# EAGLE design bicyclelab-manager-v3.1 (EAGLE 6.2)
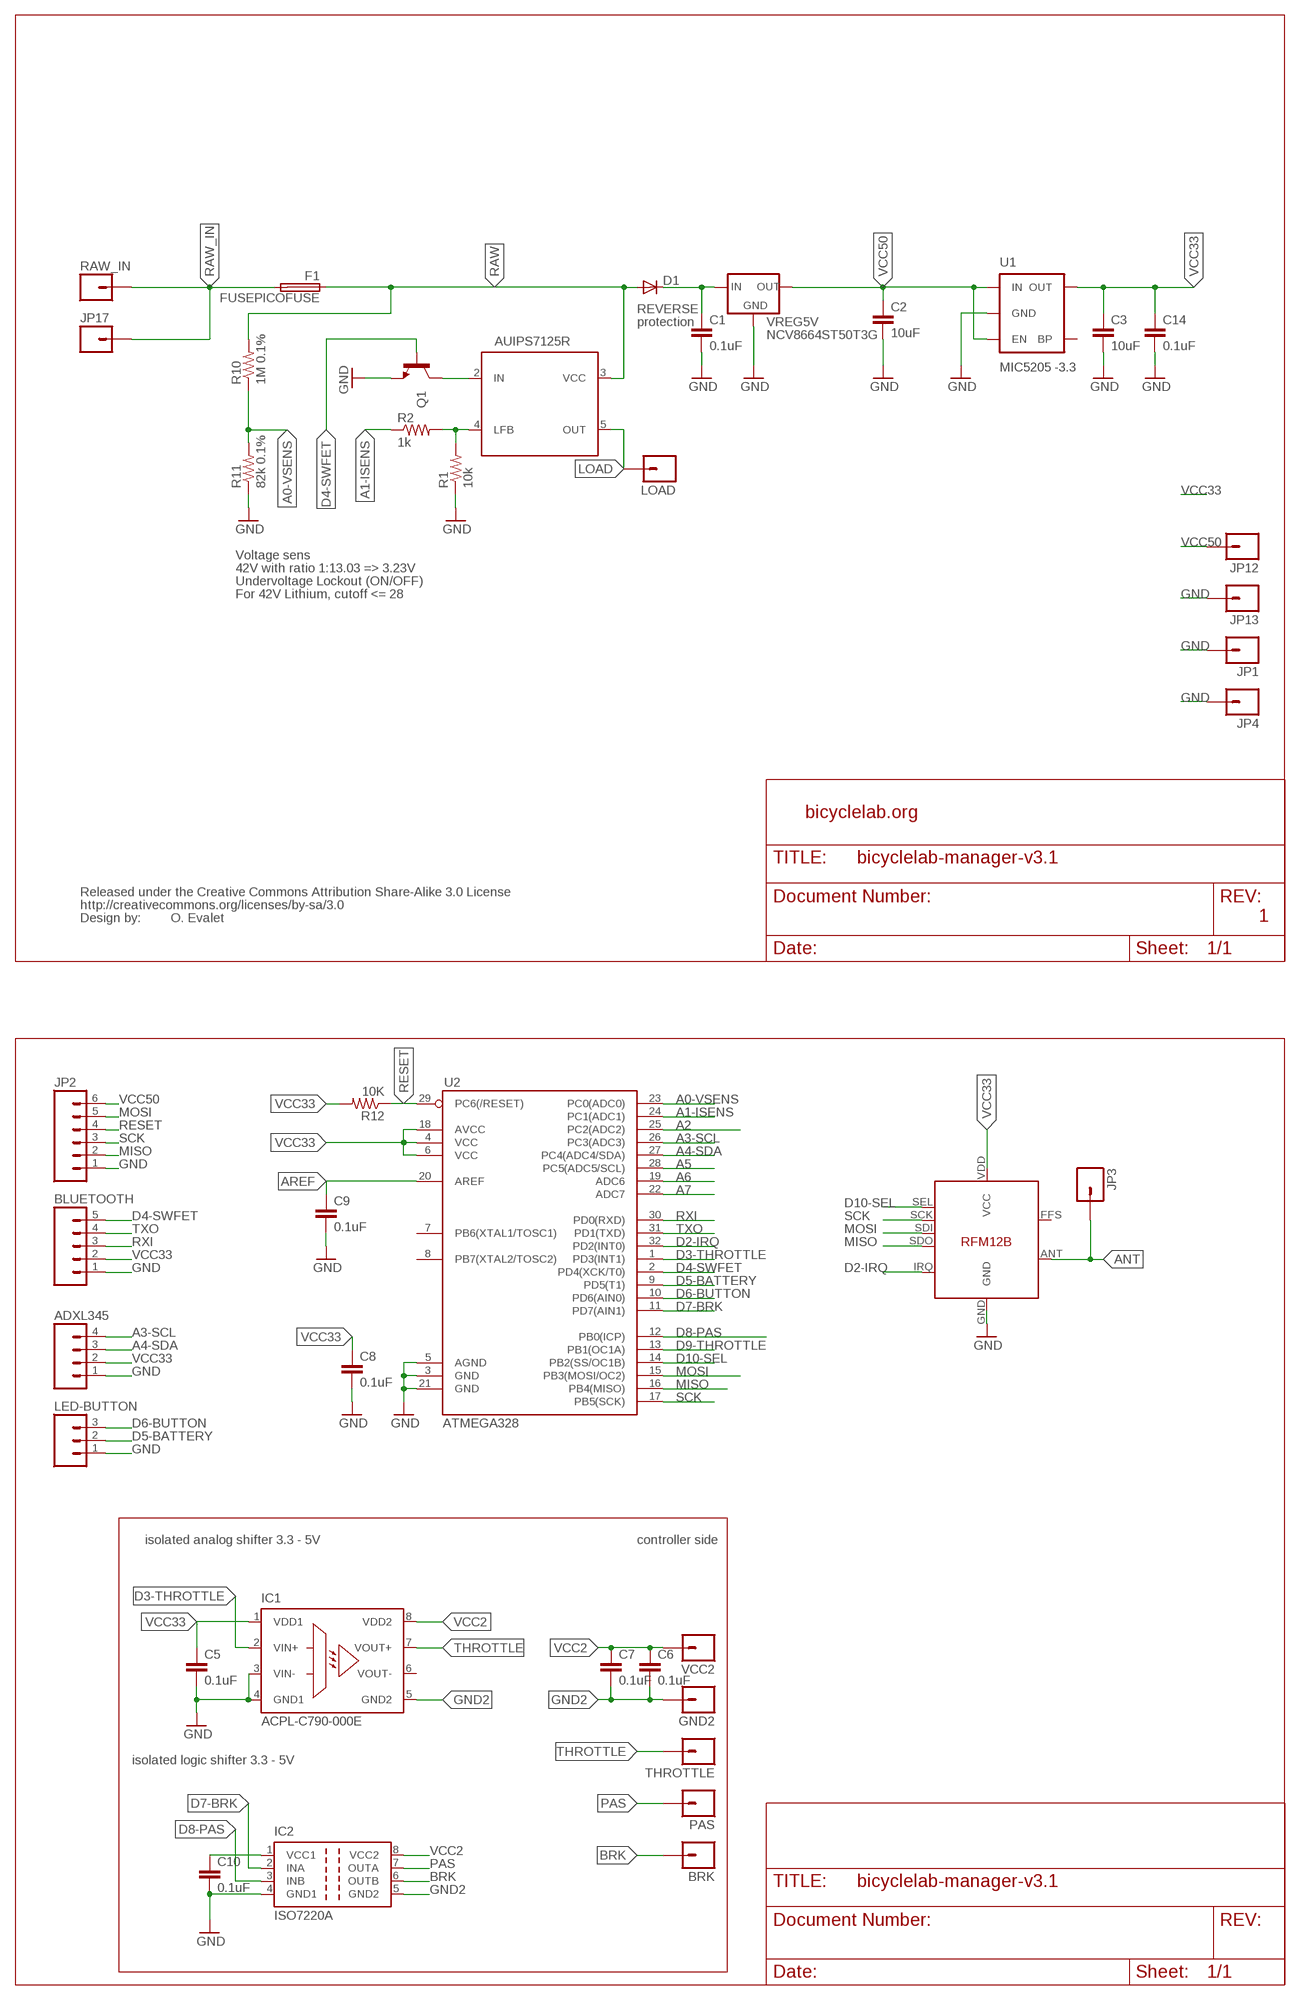
[diagram p0: schematic, sheet 1]

## Parts
ADXL345  M04PTH  [1X04]
BLUETOOTH  M05PTH  [1X05]
BRK  M01PTH  [1X01]
C1  0.1uF  CAP0805  [0805]
C2  10uF  CAP0805  [0805]
C3  10uF  CAP0805  [0805]
C5  0.1uF  CAP0805  [0805]
C6  0.1uF  CAP0805  [0805]
C7  0.1uF  CAP0805  [0805]
C8  0.1uF  CAP0603-CAP  [0603-CAP]
C9  0.1uF  CAP0603-CAP  [0603-CAP]
C10  0.1uF  CAP0805  [0805]
C14  0.1uF  CAP0603-CAP  [0603-CAP]
D1  DIODESOD  [SOD-323]
F1  FUSEPICOFUSE  [PICOFUSE]
GND2  M01PTH  [1X01]
IC1  ACPL-C790-000E  ACPL-790SSO8  [SSO8]
IC2  ISO7220A  [SO-08]
JP1  M01PTH_2MM  [1X01_2MM]
JP2  M06EM406  [EM406]
JP3  M01SMD-4.5X1.5  [PAD-1.5X4.5]
JP4  M01PTH_2MM  [1X01_2MM]
JP12  M01PTH  [1X01]
JP13  M01PTH  [1X01]
JP17  M01PTH_2MM  [1X01_2MM]
LED-BUTTON  M03PTH  [1X03]
LOAD  M01PTH_2MM  [1X01_2MM]
PAS  M01PTH  [1X01]
Q1  TRANSISTOR_NPNSOT23-3  [SOT23-3]
R1  10k  RESISTOR  [0805]
R2  1k  RESISTOR  [0805]
R10  1M 0.1%  RESISTOR  [0805]
R11  82k 0.1%  RESISTOR  [0805]
R12  10K  RESISTOR0603-RES  [0603-RES]
RAW_IN  M01PTH_2MM  [1X01_2MM]
THROTTLE  M01PTH  [1X01]
U1  MIC5205 -3.3  V_REG_LDOSMD  [SOT23-5]
U2  ATMEGA328  ATMEGA168  [TQFP32-08]
U$1  RFM12B  [RFM12B]
U$5  CREATIVE_COMMONS  [CREATIVE_COMMONS]
U$8  AUIPS7125R  [DPAK-5]
VCC2  M01PTH  [1X01]
VREG5V  NCV8664ST50T3G  V_REG_MIC2920  [SOT223]

## Nets
A0-VSENS: R10.1 R11.2 U2.23(PC0(ADC0))
A1-ISENS: R1.2 R2.1 R2.2 U2.24(PC1(ADC1)) U$8.4(LFB)
A2: U2.25(PC2(ADC2))
A3-SCL: ADXL345.4 U2.26(PC3(ADC3))
A4-SDA: ADXL345.3 U2.27(PC4(ADC4/SDA))
A5: U2.28(PC5(ADC5/SCL))
A6: U2.19(ADC6)
A7: U2.22(ADC7)
ANT: JP3.P$1 U$1.ANT
AREF: C9.1 U2.20(AREF)
BRK: BRK.1 IC2.6(OUTB)
D2-IRQ: U2.32(PD2(INT0)) U$1.IRQ
D3-THROTTLE: IC1.2(VIN+) U2.1(PD3(INT1))
D4-SWFET: BLUETOOTH.5 Q1.1(B) U2.2(PD4(XCK/T0))
D5-BATTERY: LED-BUTTON.2 U2.9(PD5(T1))
D6-BUTTON: LED-BUTTON.3 U2.10(PD6(AIN0))
D7-BRK: IC2.2(INA) U2.11(PD7(AIN1))
D8-PAS: IC2.3(INB) U2.12(PB0(ICP))
D9-THROTTLE: U2.13(PB1(OC1A))
D10-SEL: U2.14(PB2(SS/OC1B)) U$1.SEL
GND: ADXL345.1 BLUETOOTH.1 C1.2 C2.2 C3.2 C5.2 C8.2 C9.2 C10.2 C14.2 IC1.3(VIN-) IC1.4(GND1) IC2.4(GND1) JP1.1 JP2.1 JP4.1 JP13.1 LED-BUTTON.1 Q1.2(E) R1.1 R11.1 U1.2(GND) U2.3(GND) U2.5(AGND) U2.21(GND) U$1.GND VREG5V.2(GND)
GND2: C6.2 C7.2 GND2.1 IC1.5(GND2) IC2.5(GND2)
LOAD: LOAD.1 U$8.5(OUT)
MISO: JP2.2 U2.16(PB4(MISO)) U$1.SDO
MOSI: JP2.5 U2.15(PB3(MOSI/OC2)) U$1.SDI
N$1: C1.1 D1.1(C) VREG5V.1(IN)
N$2: Q1.3(C) U$8.2(IN)
PAS: IC2.7(OUTA) PAS.1
RAW: D1.2(A) F1.1 R10.2 U$8.3(VCC)
RAW_IN: F1.2 JP17.1 RAW_IN.1
RESET: JP2.4 R12.1 U2.29(PC6(/RESET))
RXI: BLUETOOTH.3 U2.30(PD0(RXD))
SCK: JP2.3 U2.17(PB5(SCK)) U$1.SCK
THROTTLE: IC1.7(VOUT+) THROTTLE.1
TXO: BLUETOOTH.4 U2.31(PD1(TXD))
VCC2: C6.1 C7.1 IC1.8(VDD2) IC2.8(VCC2) VCC2.1
VCC33: ADXL345.2 BLUETOOTH.2 C3.1 C5.1 C8.1 C10.1 C14.1 IC1.1(VDD1) IC2.1(VCC1) R12.2 U1.5(OUT) U2.4(VCC) U2.6(VCC) U2.18(AVCC) U$1.VDD(VCC)
VCC50: C2.1 JP2.6 JP12.1 U1.1(IN) U1.3(EN) VREG5V.3(OUT)
Unconnected: U1.4(BP) U2.7(PB6(XTAL1/TOSC1)) U2.8(PB7(XTAL2/TOSC2)) U$1.FFS U$8.1(NC)

## Notes on the sheet
- REVERSE
- protection
- Voltage sens
- 42V with ratio 1:13.03 => 3.23V
- Undervoltage Lockout (ON/OFF)
- For 42V Lithium, cutoff <= 28
- bicyclelab.org
- O. Evalet | 1
- isolated analog shifter 3.3 - 5V | controller side
- isolated logic shifter 3.3 - 5V

## Power pins joined to a net without a drawn wire
VOUT-: IC1.6(VOUT-)

## Library data of the parts
ADXL345 = 0-SparkFun:M04: Header 4 Standard 4-pin 0.1" header. Use with straight break away headers (SKU : PRT-00116), right angle break away headers (PRT-00553), swiss pins (PRT-00743), machine pins (PRT-00117), and female headers (PRT-00115). Molex polarized connector foot print use with SKU : PRT-08231 with associated crimp pins and housings. 1MM SMD Version SKU: PRT-10208
BLUETOOTH = 0-SparkFun:M05: Header 5 Standard 5-pin 0.1" header. Use with straight break away headers (SKU : PRT-00116), right angle break away headers (PRT-00553), swiss pins (PRT-00743), machine pins (PRT-00117), and female headers (PRT-00115). Molex polarized connector foot print use with SKU : PRT-08230 with associated crimp pins and housings.
BRK GND2 JP1 JP4 JP12 JP13 JP17 LOAD PAS RAW_IN THROTTLE VCC2 = SparkFun:M01: Header 1 Standard 1-pin 0.1" header. Use with straight break away headers (SKU : PRT-00116), right angle break away headers (PRT-00553), swiss pins (PRT-00743), machine pins (PRT-00117), and female headers (PRT-00115).
C1-C3 C5-C10 C14 = SparkFun:CAP: Capacitor Standard 0603 ceramic capacitor, and 0.1" leaded capacitor.
D1 = 0-SparkFun:DIODE: Diode These are standard reverse protection diodes and small signal diodes. SMA package can handle up to about 1A. SOD-323 can handle about 200mA. What the SOD-323 package when ordering, there are some mfgs out there that are 5-pin packages.
F1 = fuse:FUSE: Fuse; OC_FARNELL: unknown; OC_NEWARK: unknown
IC1 = bicyclelab:ACPL-790: Precision Isolation Amplifiers Source: Data sheet <http://www.avagotech.com/docs/AV02-2733EN>
IC2 = texas:ISO7220: DUAL DIGITAL ISOLATORS Source: http://focus.ti.com/lit/ds/symlink/iso7221a.pdf; MPN: ISO7220AD; OC_FARNELL: 1390649; OC_NEWARK: 48M0666
JP2 = 0-SparkFun:M06: Header 6 Standard 6-pin 0.1" header. Use with straight break away headers (SKU : PRT-00116), right angle break away headers (PRT-00553), swiss pins (PRT-00743), machine pins (PRT-00117), and female headers (PRT-00115). Molex polarized connector foot print use with SKU : PRT-08094 with associated crimp pins and housings. NOTES ON THE VARIANTS LOCK and LOCK_LONGPADS... This footprint was designed to help hold the alignment of a through-hole component (i.e. 6-pin header) while soldering it into place. You may notice that each hole has been shifted either up or down by 0.005 of an inch from it's more standard position (which is a perfectly straight line). This slight alteration caused the pins (the squares in the middle) to touch the edges of the holes. Because they are alternating, it causes a "brace" to hold the component in place. 0.005 has proven to be the perfect amount of "off-center" position when using our standard breakaway headers. Although looks a little odd when you look at the bare footprint, once you have a header in there, the alteration is very hard to notice. Also, if you push a header all the way into place, it is covered up entirely on the bottom side. This idea of altering the position of holes to aid alignment will be further integrated into the Sparkfun Library for other footprints. It can help hold any component with 3 or more connection pins.
JP3 = 0-SparkFun:M01: Header 1 Standard 1-pin 0.1" header. Use with straight break away headers (SKU : PRT-00116), right angle break away headers (PRT-00553), swiss pins (PRT-00743), machine pins (PRT-00117), and female headers (PRT-00115).
LED-BUTTON = 0-SparkFun:M03: Header 3 Standard 3-pin 0.1" header. Use with straight break away headers (SKU : PRT-00116), right angle break away headers (PRT-00553), swiss pins (PRT-00743), machine pins (PRT-00117), and female headers (PRT-00115). Molex polarized connector foot print use with SKU : PRT-08232 with associated crimp pins and housings.
Q1 = 0-SparkFun:TRANSISTOR_NPN: Transistor NPN BJT configuration in SOT23 package. MMBT2222 is the common NPN we use. Double check BCE configuration again layout.
R1 R2 R10-R12 = SparkFun:RESISTOR: Resistor Basic schematic elements and footprints for 0603, 1206, and PTH 1/10th watt (small) resistors.
U1 = SparkFun:V_REG_LDO: Voltage Regulator LDO Standard 150mA LDO voltage regulator in SOT-23 layout. Micrel part MIC5205. BP (by-pass) pin is used to lower output noise with 470pF cap.
U2 = SparkFun:ATMEGA168
U$1 = JeeParts:RFM12B
U$5 = SparkFun:CREATIVE_COMMONS
U$8 = bicyclelab:AUIPS7125R
VREG5V = 0-SparkFun:V_REG_MIC2920: MIC2920A (http://www.micrel.com/_PDF/mic2920.pdf) - 400mA output LDO Regulator

## Net classes
0 default: width 0.203 mm
1 power: width 0.508 mm

## Board
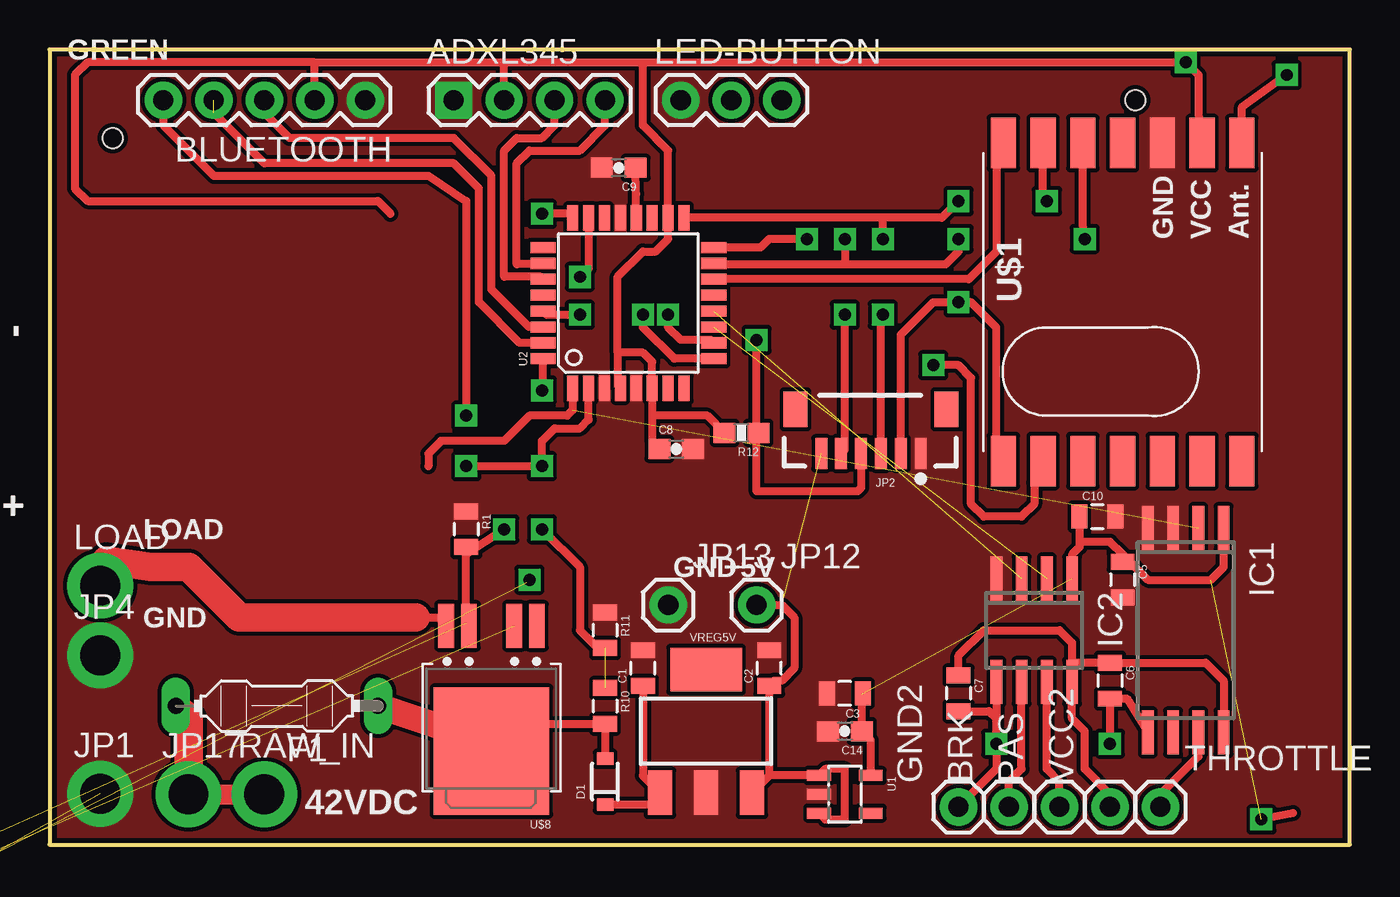
[diagram p1: board, top side]
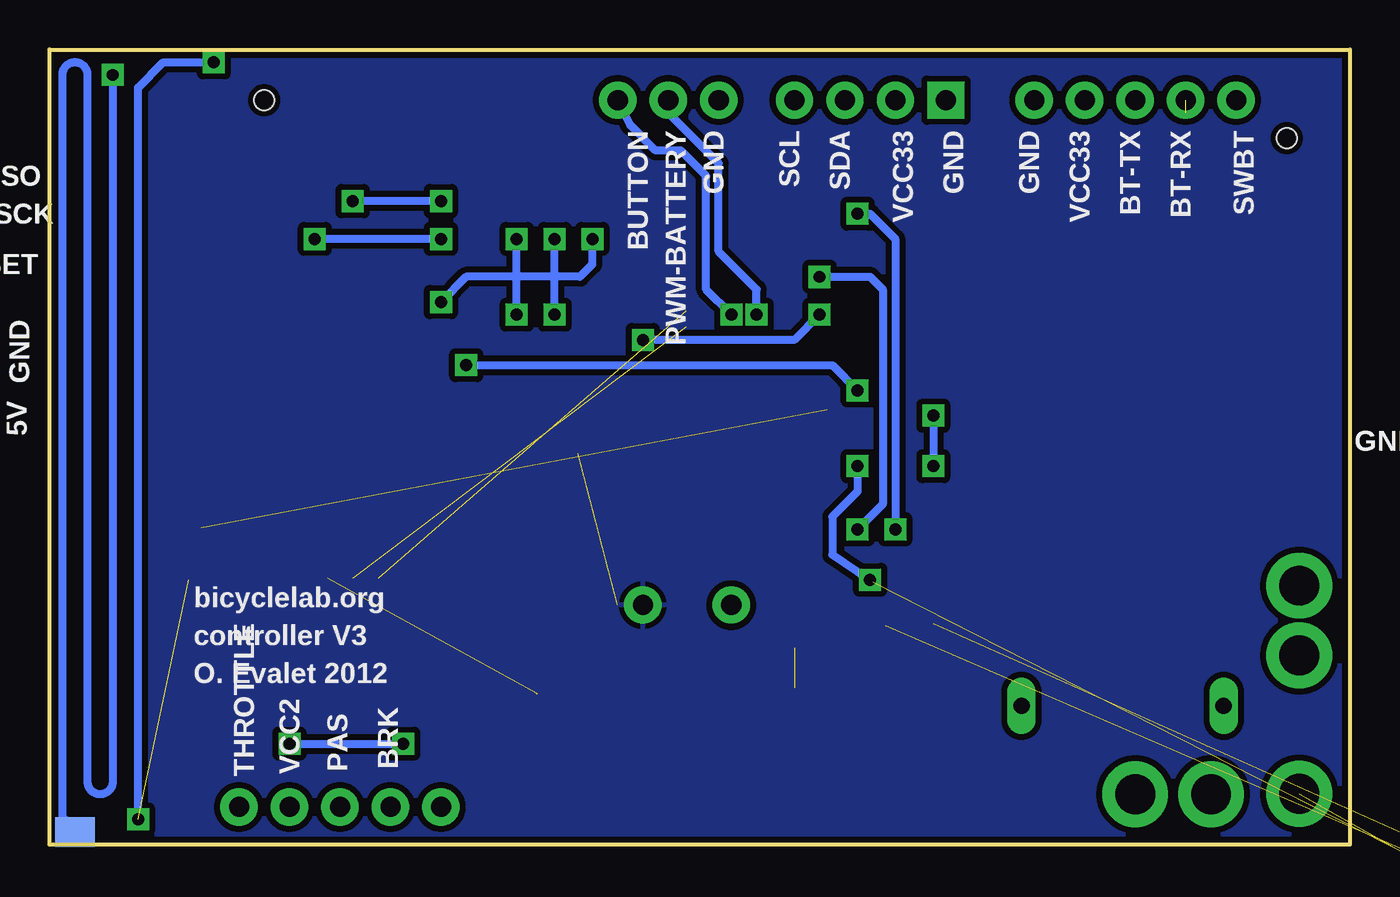
[diagram p2: board, bottom side, seen from below]

Size 65.41 x 40.01 mm. Coordinates in mm from the lower left corner, seen from the top.
Outline: 0,0 65.41,0 65.41,40.01 0,40.01 0,0
Copper layers (1*16): Top 0.035mm / dielectric 1.5mm / Bottom 0.035mm
Design rules: minimum track width 8mil, minimum drill 20mil, track to track 8mil, track to pad 8mil, pad to pad 8mil, via to via 8mil, smd to smd 8mil, copper to edge 10mil, drill to drill 8mil, minimum pad ring 12mil, minimum via ring 10mil, stop-mask expansion 4mil, vias tented up to drill 25mil, thermal gap 10mil
Holes 1 mm at 3.17,35.56 54.61,37.47

### Footprints (pad centres in the part's own frame; a part is rotated, then mirrored left to right if it is on the bottom)
1X04 = drill 1.016 pad 1.88 square: 1 0,0 | drill 1.016 pad 1.88: 2 2.54,0; 3 5.08,0; 4 7.62,0
1X05 = drill 1.016 pad 1.88: 1 0,0; 2 2.54,0; 3 5.08,0; 4 7.62,0; 5 10.16,0
1X01 = drill 1.016 pad 1.88: 1 0,0
0805 = smd 0.8 x 1.2: 1 -0.9,0; 2 0.9,0
0603-CAP = smd 1.1 x 1: 1 -0.85,0; 2 0.85,0
SOD-323 = smd 0.63 x 0.83: 1 -1.15,0; 2 1.15,0
PICOFUSE = drill 0.813 long: 1 -5.08,0; 2 5.08,0
SSO8 = smd 0.6 x 2.2: 1 -1.905,-2.6; 2 -0.635,-2.6; 3 0.635,-2.6; 4 1.905,-2.6; 5 1.905,7.68; 6 0.635,7.68; 7 -0.635,7.68; 8 -1.905,7.68
SO-08 = smd 0.6 x 2.2: 1 -1.905,-2.6; 2 -0.635,-2.6; 3 0.635,-2.6; 4 1.905,-2.6; 5 1.905,2.6; 6 0.635,2.6; 7 -0.635,2.6; 8 -1.905,2.6
1X01_2MM = drill 2 pad 3.302: 1 0,0
EM406 = smd 0.6 x 1.55: 1 0,0; 2 1,0; 3 2,0; 4 3,0; 5 4,0; 6 5,0 | smd 1.2 x 1.8: P$1 -1.3,-2.225; P$2 6.3,-2.225
PAD-1.5X4.5 = smd 1.5 x 2: P$1 0,0
1X03 = drill 1.016 pad 1.88: 1 0,0; 2 2.54,0; 3 5.08,0
SOT23-3 = smd 0.8 x 0.9: 1 -0.95,-1; 2 0.95,-1; 3 0,1.1
0603-RES = smd 1.1 x 1: 1 -0.85,0; 2 0.85,0
SOT23-5 = smd 0.55 x 1.2: 1 -0.95,-1.3; 2 0,-1.3; 3 0.95,-1.3; 4 0.95,1.3; 5 -0.95,1.3
TQFP32-08 = smd 1.27 x 0.559: 1 -4.293,2.8; 2 -4.293,2; 3 -4.293,1.2; 4 -4.293,0.4; 5 -4.293,-0.4; 6 -4.293,-1.2; 7 -4.293,-2; 8 -4.293,-2.8; 17 4.293,-2.8; 18 4.293,-2; 19 4.293,-1.2; 20 4.293,-0.4; 21 4.293,0.4; 22 4.293,1.2; 23 4.293,2; 24 4.293,2.8 | smd 0.559 x 1.27: 9 -2.8,-4.293; 10 -2,-4.293; 11 -1.2,-4.293; 12 -0.4,-4.293; 13 0.4,-4.293; 14 1.2,-4.293; 15 2,-4.293; 16 2.8,-4.293; 25 2.8,4.293; 26 2,4.293; 27 1.2,4.293; 28 0.4,4.293; 29 -0.4,4.293; 30 -1.2,4.293; 31 -2,4.293; 32 -2.8,4.293
RFM12B = smd 2.54 x 1.27: ANT 8,-6; FFS -8,2; GND 8,-2; IRQ -8,4; P$8 -8,0; P$9 -8,-2; P$10 -8,-4; P$12 -8,-6; P$16 8,0; SCK 8,4; SDI 8,2; SDO -8,6; SEL 8,6; VDD 8,-4
DPAK-5 = smd 0.8 x 2.2: 1 -2.28,-5.3; 2 -1.14,-5.3; 4 1.14,-5.3; 5 2.28,-5.3 | smd 5.8 x 6.4: 3 0,1
SOT223 = smd 1.219 x 2.235: 1 -2.311,-3.099; 2 0,-3.099; 3 2.311,-3.099 | smd 3.6 x 2.2: 4 0,3.099

### Placement (x,y rotation side)
ADXL345  20.32,37.47 0 top
BLUETOOTH  15.88,37.47 180 top
BRK  48.26,1.91 90 top
C1  29.84,8.89 90 top
C2  36.2,8.89 90 top
C3  40.01,7.62 180 top
C5  53.98,13.34 270 top
C6  53.34,8.26 270 top
C7  45.72,7.62 270 top
C8  31.52,19.91 0 top
C9  28.63,34.06 180 top
C10  52.7,16.51 0 top
C14  40.01,5.71 180 top
D1  27.94,3.17 90 top
F1  11.43,6.99 180 top
GND2  45.72,1.91 90 top
IC1  57.15,13.34 180 top
IC2  49.53,10.79 180 top
JP1  2.54,2.57 0 top
JP2  43.81,19.68 180 top
JP3  64.14,0.64 270 bottom
JP4  2.54,9.53 0 top
JP12  35.56,12.06 0 top
JP13  31.11,12.06 0 top
JP17  6.99,2.54 0 top
LED-BUTTON  31.75,37.47 0 top
LOAD  2.54,13.03 0 top
PAS  50.8,1.91 90 top
Q1  -21.59,-9.53 0 top  (outside the outline)
R1  20.95,15.88 270 top
R2  -24.77,-8.89 0 top  (outside the outline)
R10  27.94,6.99 270 top
R11  27.94,10.79 270 top
R12  34.8,20.73 180 top
RAW_IN  10.79,2.54 0 top
THROTTLE  55.88,1.91 0 top
U1  40.01,2.54 270 top
U2  29.11,27.25 90 top
U$1  53.98,27.3 90 top
U$5  1.27,-10.16 0 top  (outside the outline)
U$8  22.23,5.71 180 top
VCC2  53.34,1.91 90 top
VREG5V  33.02,5.71 0 top

### Tracks (layer width: path | path; a pad name or v marks a point on that pad's centre or on a via)
A0-VSENS  (via drill 0.6)  (1 unrouted)
  Top 0.406: U2.23 27.11,29.01 v26.67,28.57 | v24.77,15.88 26.67,13.97 26.67,10.79 27.57,9.89 R11.2
  Bottom 0.406: v26.67,28.57 24.13,28.57 23.5,27.94 23.5,17.14 v24.77,15.88
A1-ISENS  (via drill 0.6)  (2 unrouted)
  Top 0.406: U2.24 26.11,31.75 v24.77,31.75 | v22.86,15.88 20.95,14.61 | 20.95,14.61 20.69,14.97 R1.2 | U$8.4 20.95,11.14 20.95,14.61
  Bottom 0.406: v24.77,31.75 24.13,31.75 22.86,30.48 v22.86,15.88
A3-SCL
  Top 0.406: U2.26 24.77,29.21 23.5,29.21 23.5,34.29 24.13,34.92 26.67,34.92 27.94,36.2 ADXL345.4
A4-SDA
  Top 0.406: U2.27 24.7,28.57 22.86,28.57 22.86,34.92 23.5,35.56 24.77,35.56 25.4,36.2 ADXL345.3
ANT  (via drill 0.6)
  Top 0.406: U$1.ANT 59.98,37.12 v62.23,38.73
  Bottom 0.406: v62.23,38.73 62.23,3.17 arc180 63.5,3.17 63.5,38.73 arc-90 64.14,39.37 arc-90 64.77,38.73 64.77,1.27 arc90 JP3.P$1
AREF
  Top 0.406: C9.1 29.51,32.76 U2.20
BRK
  Top 0.406: BRK.1 48.26,3.17 48.9,3.81 IC2.6
D2-IRQ  (via drill 0.6)
  Top 0.406: U$1.IRQ 49.53,18.23 49.53,17.14 48.9,16.51 46.99,16.51 46.35,17.14 46.35,23.5 45.72,24.13 v44.45,24.13 | v24.77,22.86 24.82,22.91 U2.32
  Bottom 0.406: v44.45,24.13 26.04,24.13 v24.77,22.86
D3-THROTTLE  (1 unrouted)
  Top 0.406: U2.1 26.31,21.86 26.04,21.59 24.13,21.59 22.86,20.32 19.68,20.32 19.05,19.68 19.05,19.05
D4-SWFET  (via drill 0.6)  (1 unrouted)
  Top 0.406: U2.2 27.11,21.39 26.67,20.95 25.4,20.95 24.77,20.32 v24.77,19.05 v20.95,19.05 | BLUETOOTH.5 5.71,36.2 8.26,33.66 19.05,33.66 20.95,32.38 v20.95,21.59 | v24.13,13.34 24,13.21
  Bottom 0.406: v20.95,21.59 v20.95,19.05 | v24.77,19.05 24.77,17.78 26.04,16.51 26.04,14.61 v24.13,13.34
D5-BATTERY  (via drill 0.6)
  Top 0.406: U2.9 31.43,24.45 29.84,26.04 v29.84,26.67
  Bottom 0.406: v29.84,26.67 29.84,27.94 31.75,29.84 31.75,34.29 34.29,36.83 LED-BUTTON.2
D6-BUTTON  (via drill 0.6)
  Top 0.406: U2.10 33.26,25.4 31.75,25.4 31.11,26.04 v31.11,26.67
  Bottom 0.406: v31.11,26.67 32.38,27.94 32.38,33.66 33.66,34.92 34.92,34.92 36.2,36.2 LED-BUTTON.3
D7-BRK  (1 unrouted)
D8-PAS  (1 unrouted)
D10-SEL
  Top 0.406: U$1.SEL 47.62,34.32 47.62,29.84 46.23,28.45 U2.14
GND  (1 unrouted)
  pour Top (isolate 0.203, rank 2, no thermals): 0,0 0,40.01 65.41,40.01 65.41,0
GND2  (via drill 0.6)
  Top 0.406: IC1.5 54.18,7.36 C6.2 v53.34,5.08 | IC2.5 47.62,6.35 | GND2.1 47.62,3.81 v47.62,5.08 47.62,6.35 | C7.2 47.26,6.72 47.62,6.35
  Bottom 0.406: v53.34,5.08 v47.62,5.08
LOAD
  Top 0.406: 18.41,11.43 19.53,11.43 U$8.5
  Top 1.422: LOAD.1 2.85,14.3 5.08,13.97 6.99,13.97 9.53,11.43 18.41,11.43
MISO  (via drill 0.6)
  Top 0.406: U$1.SDO 47.62,19.02 47.62,26.04 46.35,27.3 v45.72,27.3 44.45,27.3 42.81,25.67 JP2.2 | v38.1,30.48 36.2,30.48 35.77,30.05 U2.16
  Bottom 0.406: v38.1,30.48 38.1,29.21 38.73,28.57 44.45,28.57 v45.72,27.3
MOSI  (via drill 0.6)
  Top 0.406: U2.15 33.45,29.21 40.01,29.21 | 40.01,29.21 45.09,29.21 45.72,29.84 v45.72,30.48 | v52.07,30.48 51.98,31.21 U$1.SDI | JP2.5 40.01,19.88 v40.01,26.67 | v40.01,30.48 40.01,29.21
  Bottom 0.406: v45.72,30.48 v52.07,30.48 | v40.01,26.67 v40.01,30.48
N$1
  Top 0.406: C1.1 29.84,3.48 VREG5V.1 30.48,2.39 30.48,1.91 30.36,2.02 D1.1
N$2  (1 unrouted)
PAS
  Top 0.406: PAS.1 50.8,3.17 50.16,3.81 IC2.7
RAW
  Top 0.406: U$8.3 23.59,6.08 R10.2 D1.2
  Top 1.27: F1.1 20.32,5.71 22.86,5.71 22.23,5.08 U$8.3
RAW_IN
  Top 1.016: JP17.1 RAW_IN.1
  Top 1.422: JP17.1 6.99,6.35 F1.2
RESET  (via drill 0.6)
  Top 0.406: U2.29 25,26.67 v26.67,26.67 | v35.56,25.4 35.56,20.81 R12.1 35.56,20.64 35.56,17.78 40.64,17.78 40.81,17.95 JP2.4
  Bottom 0.406: v26.67,26.67 27.94,25.4 v35.56,25.4
RXI
  Top 0.406: U2.30 24.11,26.05 22.23,27.94 22.23,33.66 20.32,35.56 12.06,35.56 10.79,36.83 BLUETOOTH.3
SCK  (via drill 0.6)
  Top 0.406: 50.16,34.86 U$1.SCK 49.98,32.58 v50.16,32.38 | v45.72,32.38 44.88,31.55 41.91,31.55 | 41.91,31.55 U2.17 | JP2.3 41.81,26.57 v41.91,26.67 | v41.91,30.48 41.91,31.55
  Bottom 0.406: v45.72,32.38 v50.16,32.38 | v41.91,26.67 v41.91,30.48
THROTTLE
  Top 0.406: THROTTLE.1 55.88,2.54 57.78,4.45 IC1.7
TXO  (1 unrouted)
  Top 0.406: U2.31 23.64,25.25 21.59,27.3 21.59,33.02 20.32,34.29 10.79,34.29 8.26,36.83
VCC2
  Top 0.406: IC1.8 59.05,8.26 58.16,9.15 C6.1 51.7,9.15 51.44,8.89 | C7.1 45.72,9.53 46.99,10.79 50.8,10.79 51.44,10.16 51.44,8.89 | 51.44,8.89 IC2.8 51.44,6.35 52.07,5.71 52.07,3.81 53.34,2.54 VCC2.1
VCC33  (via drill 0.6)  (3 unrouted)
  Top 0.406: U1.5 41.3,5.26 C14.1 40.85,7.57 | 13.34,39.37 22.86,39.37 | 22.86,39.37 29.84,39.37 | 29.84,39.37 v57.15,39.37 57.78,38.73 57.78,36.77 U$1.VDD | ADXL345.2 22.86,39.37 | 29.84,39.37 29.84,36.2 31.11,34.93 U2.18 31.11,30.47 30.48,29.84 29.84,29.84 28.57,28.57 28.57,24.77 | 30.31,21.59 U2.6 30.31,24.3 29.84,24.77 28.57,24.77 | 30.31,21.59 30.31,20.36 C8.1 | 28.57,24.77 28.57,23.09 U2.4 | R12.2 33.08,21.59 30.31,21.59 | 62.55,1.58 v60.96,1.27 | IC2.1 51.44,14.61 51.8,14.97 51.8,15.24 | C10.1 51.8,15.24 | BLUETOOTH.2 13.34,39.37 | 13.34,39.37 1.91,39.37 1.27,38.73 1.27,33.02 1.91,32.38 16.51,32.38 17.14,31.75 | C5.1 53.98,14.61 | 53.98,14.61 53.34,15.24 51.8,15.24 | 53.98,14.61 55.24,13.34 58.42,13.34 59.05,13.97 IC1.1
  Bottom 0.406: v60.96,1.27 60.96,38.1 59.69,39.37 v57.15,39.37
VCC50  (1 unrouted)
  Top 0.406: 36.2,3.48 36.2,3.49 U1.1 39.02,3.81 40.01,3.81 40.01,1.27 39.02,1.27 U1.3 | 36.2,3.48 VREG5V.3 | 36.2,3.48 C2.1 36.46,8.26 36.83,8.26 37.47,8.89 37.47,11.43 36.83,12.06 JP12.1
  pour Bottom (isolate 0.305): 0,40.01 65.41,40.01 65.41,0 0,0

### Text on the board
tPlace: GREEN | - | + | LOAD | GND | +5V | GND | 42VDC
bPlace: SWBT | BT-RX | BT-TX | VCC33 | GND | GND | VCC33 | SDA | SCL | GND | PWM-BATTERY | BUTTON | MISO | SCK | RESET | GND | GND | 5V | bicyclelab.org | controller V3 | O. Evalet 2012 | BRK | PAS | VCC2 | THROTTLE